# EAGLE schematic cs8416 (EAGLE 4.15)
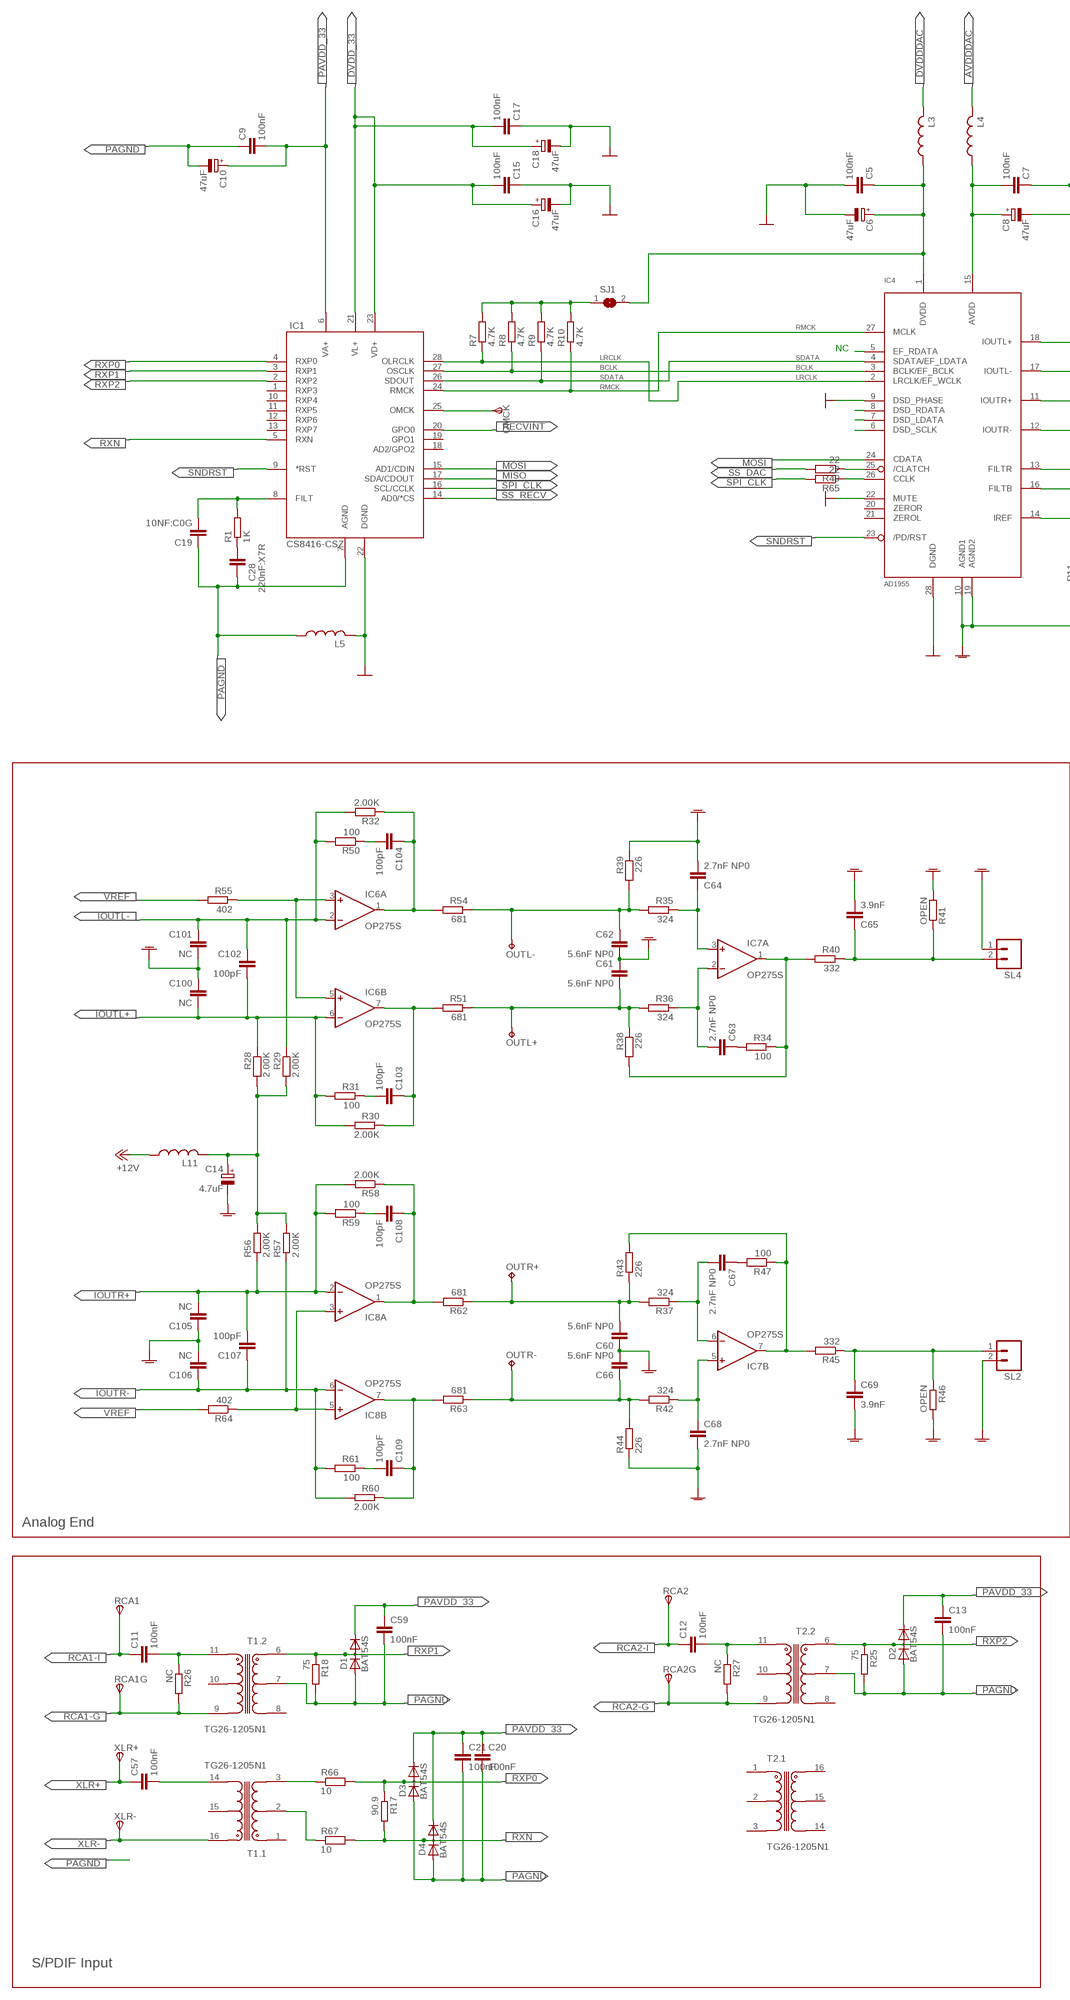
[diagram p0: schematic, sheet 1, part 1 of 2]
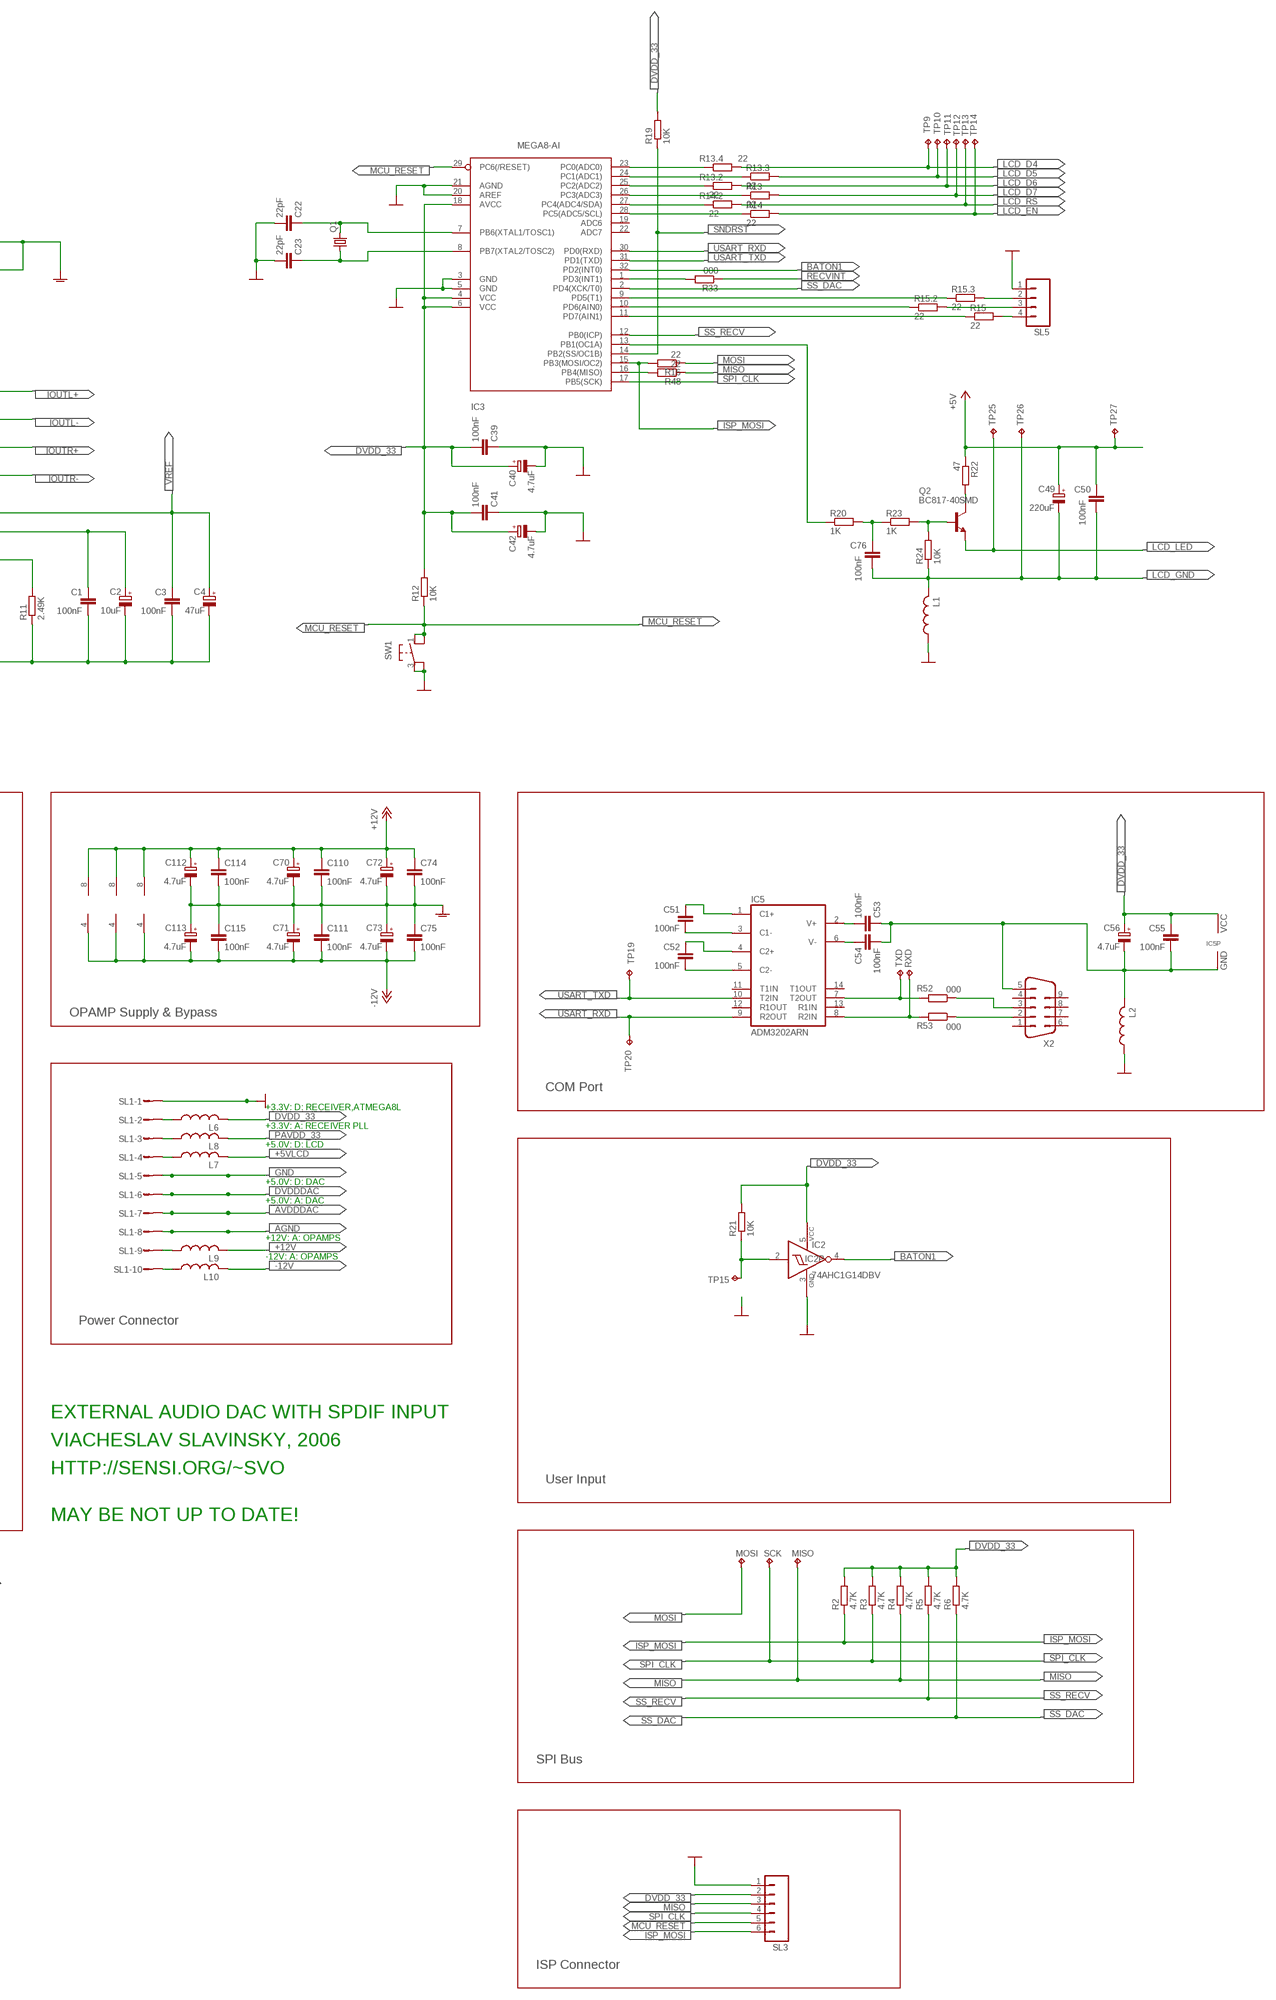
[diagram p1: schematic, sheet 1, part 2 of 2]

## Parts
C1  100nF  C-EUC0603  [C0603]
C2  10uF  CPOL-EUA/3216-18R  [A/3216-18R]
C3  100nF  C-EUC0603  [C0603]
C4  47uF  CPOL-EUB/3528-21R  [B/3528-21R]
C5  100nF  C-EUC0603  [C0603]
C6  47uF  CPOL-EUB/3528-21R  [B/3528-21R]
C7  100nF  C-EUC0603  [C0603]
C8  47uF  CPOL-EUB/3528-21R  [B/3528-21R]
C9  100nF  C-EUC0603  [C0603]
C10  47uF  CPOL-EUB/3528-21R  [B/3528-21R]
C11  100nF  C-EUC0603K  [C0603K]
C12  100nF  C-EUC0603K  [C0603K]
C13  100nF  C-EUC0603  [C0603]
C14  4.7uF  CPOL-EUB/3528-21R  [B/3528-21R]
C15  100nF  C-EUC0603  [C0603]
C16  47uF  CPOL-EUB/3528-21R  [B/3528-21R]
C17  100nF  C-EUC0603  [C0603]
C18  47uF  CPOL-EUB/3528-21R  [B/3528-21R]
C19  10NF:C0G  C-EUC0805  [C0805]
C20  100nF  C-EUC0603  [C0603]
C21  100nF  C-EUC0603  [C0603]
C22  22pF  C-EUC0603  [C0603]
C23  22pF  C-EUC0603  [C0603]
C28  220nF:X7R  C-EUC0805  [C0805]
C39  100nF  C-EUC0603  [C0603]
C40  4.7uF  CPOL-EUA/3216-18R  [A/3216-18R]
C41  100nF  C-EUC0603  [C0603]
C42  4.7uF  CPOL-EUA/3216-18R  [A/3216-18R]
C49  220uF  CPOL-EUSMCE  [SMC_E]
C50  100nF  C-EUC0603  [C0603]
C51  100nF  C-EUC0805S  [C0805S]
C52  100nF  C-EUC0805S  [C0805S]
C53  100nF  C-EUC0805S  [C0805S]
C54  100nF  C-EUC0805S  [C0805S]
C55  100nF  C-EUC0805S  [C0805S]
C56  4.7uF  CPOL-EUA/3216-18R  [A/3216-18R]
C57  100nF  C-EUC0603K  [C0603K]
C59  100nF  C-EUC0603  [C0603]
C60  5.6nF NP0  C-EUC0805  [C0805]
C61  5.6nF NP0  C-EUC0805  [C0805]
C62  5.6nF NP0  C-EUC0805  [C0805]
C63  2.7nF NP0  C-EUC0805  [C0805]
C64  2.7nF NP0  C-EUC0805  [C0805]
C65  3.9nF  C-EUC0805  [C0805]
C66  5.6nF NP0  C-EUC0805  [C0805]
C67  2.7nF NP0  C-EUC0805  [C0805]
C68  2.7nF NP0  C-EUC0805  [C0805]
C69  3.9nF  C-EUC0805  [C0805]
C70  4.7uF  CPOL-EUB/3528-21R  [B/3528-21R]
C71  4.7uF  CPOL-EUB/3528-21R  [B/3528-21R]
C72  4.7uF  CPOL-EUB/3528-21R  [B/3528-21R]
C73  4.7uF  CPOL-EUB/3528-21R  [B/3528-21R]
C74  100nF  C-EUC0603  [C0603]
C75  100nF  C-EUC0603  [C0603]
C76  100nF  C-EUC0805  [C0805]
C100  NC  C-EUC0805S  [C0805S]
C101  NC  C-EUC0805S  [C0805S]
C102  100pF  C-EUC0805S  [C0805S]
C103  100pF  C-EUC0805S  [C0805S]
C104  100pF  C-EUC0805S  [C0805S]
C105  NC  C-EUC0805S  [C0805S]
C106  NC  C-EUC0805S  [C0805S]
C107  100pF  C-EUC0805S  [C0805S]
C108  100pF  C-EUC0805S  [C0805S]
C109  100pF  C-EUC0805S  [C0805S]
C110  100nF  C-EUC0603  [C0603]
C111  100nF  C-EUC0603  [C0603]
C112  4.7uF  CPOL-EUB/3528-21R  [B/3528-21R]
C113  4.7uF  CPOL-EUB/3528-21R  [B/3528-21R]
C114  100nF  C-EUC0603  [C0603]
C115  100nF  C-EUC0603  [C0603]
D1  BAT54S  DIODE_2CACA-SOT23  [SOT23]
D2  BAT54S  DIODE_2CACA-SOT23  [SOT23]
D3  BAT54S  DIODE_2CACA-SOT23  [SOT23]
D4  BAT54S  DIODE_2CACA-SOT23  [SOT23]
IC1  CS8416-CSZ  [SO28W]
IC2  74AHC1G14DBV  [SOT23-5]
IC3  MEGA8-AI  [TQFP32-08]
IC4  AD1955  [SSOP28]
IC5  ADM3202ARN  [SO16]
IC6  OP275S  OP262D  [SO08]
IC7  OP275S  OP262D  [SO08]
IC8  OP275S  OP262D  [SO08]
L1  L-USL2825P  [L2825P]
L2  L-USL2825P  [L2825P]
L3  L-USL2825P  [L2825P]
L4  L-USL2825P  [L2825P]
L5  L-USL2825P  [L2825P]
L6  L-USL3216C  [L3216C]
L7  L-USL3216C  [L3216C]
L8  L-USL3216C  [L3216C]
L9  L-USL3216C  [L3216C]
L10  L-USL3216C  [L3216C]
L11  L-USL3216C  [L3216C]
MISO  TPTP10R  [TP10R]
MOSI  TPTP10R  [TP10R]
OMCK  TPSPAD1-13Y  [P1-13Y]
OUTL+  TPB1,27  [B1,27]
OUTL-  TPB1,27  [B1,27]
OUTR+  TPB1,27  [B1,27]
OUTR-  TPB1,27  [B1,27]
Q1  CRYTALHC49S  [HC49/S]
Q2  BC817-40SMD  [SOT23-BEC]
R1  1K  R-EU_R0805S  [R0805-SVO]
R2  4.7K  R-EU_R0805S  [R0805-SVO]
R3  4.7K  R-EU_R0805S  [R0805-SVO]
R4  4.7K  R-EU_R0805S  [R0805-SVO]
R5  4.7K  R-EU_R0805S  [R0805-SVO]
R6  4.7K  R-EU_R0805S  [R0805-SVO]
R7  4.7K  R-EU_R0603  [R0603]
R8  4.7K  R-EU_R0603  [R0603]
R9  4.7K  R-EU_R0603  [R0603]
R10  4.7K  R-EU_R0603  [R0603]
R11  2.49K  R-EU_0204/7  [0204/7]
R12  10K  R-EU_R0805S  [R0805-SVO]
R13  22  RESARRAY_YC  [RESSMD-YC16]
R14  22  RESARRAY_YC  [RESSMD-YC16]
R15  22  RESARRAY_YC  [RESSMD-YC16]
R16  22  R-EU_R0603  [R0603]
R17  90.9  R-EU_R0805S  [R0805-SVO]
R18  75  R-EU_R0805S  [R0805-SVO]
R19  10K  R-EU_R0805S  [R0805-SVO]
R20  1K  R-EU_R0805S  [R0805-SVO]
R21  10K  R-EU_R0805S  [R0805-SVO]
R22  47  R-EU_R0805S  [R0805-SVO]
R23  1K  R-EU_R0805S  [R0805-SVO]
R24  10K  R-EU_R0805S  [R0805-SVO]
R25  75  R-EU_R0805S  [R0805-SVO]
R26  NC  R-EU_R0805S  [R0805-SVO]
R27  NC  R-EU_R0805S  [R0805-SVO]
R28  2.00K  R-EU_0204/7  [0204/7]
R29  2.00K  R-EU_0204/7  [0204/7]
R30  2.00K  R-EU_0204/7  [0204/7]
R31  100  R-EU_R0805S  [R0805-SVO]
R32  2.00K  R-EU_0204/7  [0204/7]
R33  000  R-EU_GAP  [R1206-GAP]
R34  100  R-EU_R0805S  [R0805-SVO]
R35  324  R-EU_0204/7  [0204/7]
R36  324  R-EU_0204/7  [0204/7]
R37  324  R-EU_0204/7  [0204/7]
R38  226  R-EU_0204/7  [0204/7]
R39  226  R-EU_0204/7  [0204/7]
R40  332  R-EU_0204/7  [0204/7]
R41  OPEN  R-EU_R0805  [R0805]
R42  324  R-EU_0204/7  [0204/7]
R43  226  R-EU_0204/7  [0204/7]
R44  226  R-EU_0204/7  [0204/7]
R45  332  R-EU_0204/7  [0204/7]
R46  OPEN  R-EU_R0805  [R0805]
R47  100  R-EU_R0805S  [R0805-SVO]
R48  22  R-EU_R0603  [R0603]
R49  22  R-EU_R0603  [R0603]
R50  100  R-EU_R0805S  [R0805-SVO]
R51  681  R-EU_0204/7  [0204/7]
R52  000  R-EU_GAP  [R1206-GAP]
R53  000  R-EU_GAP  [R1206-GAP]
R54  681  R-EU_0204/7  [0204/7]
R55  402  R-EU_0204/7  [0204/7]
R56  2.00K  R-EU_0204/7  [0204/7]
R57  2.00K  R-EU_0204/7  [0204/7]
R58  2.00K  R-EU_0204/7  [0204/7]
R59  100  R-EU_R0805S  [R0805-SVO]
R60  2.00K  R-EU_0204/7  [0204/7]
R61  100  R-EU_R0805S  [R0805-SVO]
R62  681  R-EU_0204/7  [0204/7]
R63  681  R-EU_0204/7  [0204/7]
R64  402  R-EU_0204/7  [0204/7]
R65  22  R-EU_R0603  [R0603]
R66  10  R-EU_R0805S  [R0805-SVO]
R67  10  R-EU_R0805S  [R0805-SVO]
RCA1  TPSPAD1-13  [P1-13]
RCA1G  TPSPAD1-13  [P1-13]
RCA2  TPSPAD1-13  [P1-13]
RCA2G  TPSPAD1-13  [P1-13]
RXD  TPB1,27  [B1,27]
SCK  TPTP10R  [TP10R]
SJ1  SJ  [SJ]
SL1  M10S  [10P]
SL2  M02  [02P]
SL3  M06  [06P]
SL4  M02  [02P]
SL5  M04  [04P]
SW1  BUTTON_6X6_THRU  [6X6_BUTTON_THRU]
T1  TG26-1205N1  [SO16WW]
T2  TG26-1205N1  [SO16WW]
TP9  TPPAD1-10Y  [P1-13Y-SVO]
TP10  TPPAD1-10Y  [P1-13Y-SVO]
TP11  TPPAD1-10Y  [P1-13Y-SVO]
TP12  TPPAD1-10Y  [P1-13Y-SVO]
TP13  TPPAD1-10Y  [P1-13Y-SVO]
TP14  TPPAD1-10Y  [P1-13Y-SVO]
TP15  TPPAD1-10Y  [P1-13Y-SVO]
TP19  TPTP10R  [TP10R]
TP20  TPTP10R  [TP10R]
TP25  TPPAD1-10Y  [P1-13Y-SVO]
TP26  TPPAD1-10Y  [P1-13Y-SVO]
TP27  TPPAD1-10Y  [P1-13Y-SVO]
TXD  TPB1,27  [B1,27]
X2  M09HP  [M09HP]
XLR+  TPSPAD1-13  [P1-13]
XLR-  TPSPAD1-13  [P1-13]

## Nets
+5VLCD [supply]: C49.+ C50.1 L7.2 R22.1 TP27.1(TP) ; supply symbol labelled +5V
+12V [supply]: C70.+ C72.+ C74.1 C110.1 C112.+ C114.1 IC6.8(P:V+) IC7.8(P:V+) IC8.8(P:V+) L9.2 L11.1
-12V [supply]: C71.- C73.- C75.2 C111.2 C113.- C115.2 IC6.4(P:V-) IC7.4(P:V-) IC8.4(P:V-) L10.2
AGND: C1.2 C2.- C3.2 C4.- C7.1 C8.- C14.- C60.1 C61.1 C62.2 C64.2 C65.2 C66.2 C68.2 C69.2 C70.- C71.+ C72.- C73.+ C74.2 C75.1 C100.1 C101.2 C105.1 C106.2 C110.2 C111.1 C112.- C113.+ C114.2 C115.1 IC4.10(AGND1) IC4.19(AGND2) R11.1 R39.1 R41.2 R44.1 R46.2 SL1.8 SL2.2 SL4.1
AVDD: C7.2 C8.+ IC4.15(AVDD) L4.1
AVDDDAC [supply]: L4.2 SL1.7
B1IN: IC2.2(I) R21.1 TP15.1(TP)
BATON1: IC2.4(O) IC3.32(PD2(INT0))
BCLK: IC1.27(OSCLK) IC4.3(BCLK/EF_BCLK) R8.1
COM_GND [supply]: C53.1 C54.2 C55.2 C56.- IC5.15(GND) L2.2 X2.5
COM_RXD: IC5.8(R2IN) R53.2 RXD.PP(TP)
COM_TXD: IC5.7(T2OUT) R52.2 TXD.PP(TP)
DVDD: C5.1 C6.+ IC4.1(DVDD) L3.1 SJ1.2
DVDD_33 [supply]: C15.2 C16.+ C17.2 C18.+ C39.2 C40.+ C41.2 C42.+ C55.1 C56.+ IC1.21(VL+) IC1.23(VD+) IC2.5(VCC) IC3.4(VCC) IC3.6(VCC) IC3.18(AVCC) IC5.16(VCC) L6.2 R2.2 R3.2 R4.2 R5.2 R6.2 R12.2 R19.2 R21.2 SL3.2
DVDDDAC [supply]: L3.2 SL1.6
GND [supply]: C5.2 C6.- C15.1 C16.- C17.1 C18.- C22.2 C23.2 C39.1 C40.- C41.1 C42.- IC1.22(DGND) IC2.3(GND) IC3.3(GND) IC3.5(GND) IC3.20(AREF) IC3.21(AGND) IC4.9(DSD_PHASE) IC4.22(MUTE) IC4.28(DGND) L1.1 L2.1 L5.2 SL1.1 SL1.5 SL3.1 SL5.1 SW1.3(P1) SW1.4(P1)
IOUTL+: C100.2 C102.2 IC4.18(IOUTL+) IC6.6(B:-IN) R28.1 R30.2 R31.2
IOUTL-: C101.1 C102.1 IC4.17(IOUTL-) IC6.2(A:-IN) R29.1 R32.2 R50.2
IOUTR+: C105.2 C107.2 IC4.11(IOUTR+) IC8.2(A:-IN) R56.1 R58.2 R59.2
IOUTR-: C106.1 C107.1 IC4.12(IOUTR-) IC8.6(B:-IN) R57.1 R60.2 R61.2
ISP_MOSI: IC3.15(PB3(MOSI/OC2)) R2.1 R16.2 SL3.6
LCD_D4: R13.R4$2 TP9.1(TP)
LCD_D5: R13.R3$2 TP10.1(TP)
LCD_D6: R13.R2$2 TP11.1(TP)
LCD_D7: R13.R1$2 TP12.1(TP)
LCD_EN: R14.R1$2 TP14.1(TP)
LCD_GND: C49.- C50.2 C76.2 L1.2 R24.1 TP26.1(TP)
LCD_LED: Q2.E TP25.1(TP)
LCD_PWMIN: IC3.13(PB1(OC1A)) R20.1
LCD_RS: R14.R2$2 TP13.1(TP)
LRCLK: IC1.28(OLRCLK) IC4.2(LRCLK/EF_WCLK) R7.1
MCU_RESET: IC3.29(PC6(/RESET)) R12.1 SL3.5 SW1.1(P2) SW1.2
MISO: IC1.17(SDA/CDOUT) MISO.TP R4.1 R48.1 SL3.3
MOSI: IC1.15(AD1/CDIN) IC4.24(CDATA) MOSI.TP R16.1
N$1: C28.2 R1.1
N$2: IC4.5(EF_RDATA)
N$3 [supply]: C11.2 R26.1 T1.11(.2:SEC1)
N$4: IC4.6(DSD_SCLK)
N$5: IC4.7(DSD_LDATA)
N$6: IC4.8(DSD_RDATA)
N$7 [supply]: C12.2 R27.1 T2.11(.2:SEC1)
N$8: C57.2 T1.14(.1:SEC3)
N$9: C76.1 R20.2 R23.1
N$11: C22.1 IC3.7(PB6(XTAL1/TOSC1)) Q1.2
N$12: R7.2 R8.2 R9.2 R10.2 SJ1.1
N$15: C51.2 IC5.3(C1-)
N$16: Q2.C R22.2
N$18: IC3.23(PC0(ADC0)) R13.R4$1
N$19: IC3.24(PC1(ADC1)) R13.R3$1
N$20: IC3.25(PC2(ADC2)) R13.R2$1
N$21: IC3.26(PC3(ADC3)) R13.R1$1
N$22: IC3.27(PC4(ADC4/SDA)) R14.R2$1
N$23: IC3.28(PC5(ADC5/SCL)) R14.R1$1
N$24 [supply]: C103.2 R31.1
N$25: Q2.B R23.2 R24.2
N$26: C51.1 IC5.1(C1+)
N$27: C52.1 IC5.4(C2+)
N$28: R15.R2$2 SL5.3
N$29: R15.R1$2 SL5.4
N$30: R15.R3$2 SL5.2
N$31: IC3.9(PD5(T1)) R15.R3$1
N$32: IC3.10(PD6(AIN0)) R15.R2$1
N$33: IC3.11(PD7(AIN1)) R15.R1$1
N$34: C52.2 IC5.5(C2-)
N$35: C53.2 IC5.2(V+)
N$36: C54.1 IC5.6(V-)
N$37: IC4.14(IREF) R11.2
N$38 [supply]: L6.1 SL1.2
N$39: C1.1 C2.+ IC4.16(FILTB)
N$40: C63.2 IC7.2(A:-IN) R36.1
N$41: C64.1 IC7.3(A:+IN) R35.1
N$42 [supply]: C103.1 IC6.7(B:OUT) R30.1 R51.2
N$43: IC3.16(PB4(MISO)) R48.2
N$44: C67.2 IC7.6(B:-IN) R37.1
N$45: C68.1 IC7.5(B:+IN) R42.1
N$46 [supply]: L7.1 SL1.4
N$48: C63.1 R34.2
N$50: IC7.7(B:OUT) R43.2 R45.2 R47.1
N$51: R53.1 X2.2
N$52: IC7.1(A:OUT) R34.1 R38.2 R40.2
N$53 [supply]: L8.1 SL1.3
N$54 [supply]: L9.1 SL1.9
N$55: C67.1 R47.2
N$56: IC4.26(CCLK) R65.1
N$57: IC4.25(/CLATCH) R49.1
N$58: R52.1 X2.3
N$60 [supply]: L10.1 SL1.10
N$61 [supply]: C14.+ L11.2 R28.2 R29.2 R56.2 R57.2
N$62: R66.1 T1.3(.1:PRI3)
N$63: R67.1 T1.2(.1:PRI2)
N$79 [supply]: C104.1 IC6.1(A:OUT) R32.1 R54.2
N$80 [supply]: C108.1 IC8.1(A:OUT) R58.1 R62.2
N$81 [supply]: C104.2 R50.1
N$82 [supply]: C108.2 R59.1
N$83 [supply]: C109.1 IC8.7(B:OUT) R60.1 R63.2
N$84 [supply]: C109.2 R61.1
N$88: C23.1 IC3.8(PB7(XTAL2/TOSC2)) Q1.1
OMCK: IC1.25(OMCK) OMCK.1(PP)
PAGND [supply]: C9.1 C10.- C13.2 C19.1 C20.2 C21.2 C28.1 C59.2 D1.1(A) D2.1(A) D3.1(A) D4.1(A) IC1.7(AGND) L5.1 R18.2 R25.2 T1.7(.2:PRI2) T2.7(.2:PRI2)
PAVDD_33 [supply]: C9.2 C10.+ C13.1 C20.1 C21.1 C59.1 D1.2(C) D2.2(C) D3.2(C) D4.2(C) IC1.6(VA+) L8.2
PLL_LF1: C19.2 IC1.8(FILT) R1.2
RCA1-G: R26.2 RCA1G.1(PP) T1.9(.2:SEC3)
RCA1-I: C11.1 RCA1.1(PP)
RCA2-G: R27.2 RCA2G.1(PP) T2.9(.2:SEC3)
RCA2-I: C12.1 RCA2.1(PP)
RECVINT: IC1.20(GPO0) R33.1
RMCK: IC1.24(RMCK) IC4.27(MCLK) R10.1
RXN: D4.3(AC) IC1.5(RXN) R17.2 R67.2
RXP0: D3.3(AC) IC1.4(RXP0) R17.1 R66.2
RXP1: D1.3(AC) IC1.3(RXP1) R18.1 T1.6(.2:PRI1)
RXP2: D2.3(AC) IC1.2(RXP2) R25.1 T2.6(.2:PRI1)
SDATA: IC1.26(SDOUT) IC4.4(SDATA/EF_LDATA) R9.1
SNDRST: IC1.9(*RST) IC3.14(PB2(SS/OC1B)) IC4.23(/PD/RST) R19.1
SPDIF_INT: IC3.1(PD3(INT1)) R33.2
SPI_CLK: IC1.16(SCL/CCLK) IC3.17(PB5(SCK)) R3.1 R65.2 SCK.TP SL3.4
SS_DAC: IC3.2(PD4(XCK/T0)) R6.1 R49.2
SS_RECV: IC1.14(AD0/*CS) IC3.12(PB0(ICP)) R5.1
USART_RXD: IC3.30(PD0(RXD)) IC5.9(R2OUT) TP20.TP
USART_TXD: IC3.31(PD1(TXD)) IC5.10(T2IN) TP19.TP
VBIASX: IC6.3(A:+IN) IC6.5(B:+IN) R55.1
VBIASY: IC8.3(A:+IN) IC8.5(B:+IN) R64.1
VOUT_LEFT: C65.1 R40.1 R41.1 SL4.2
VOUT_RIGHT: C69.1 R45.1 R46.1 SL2.1
VOUTL+: C61.2 OUTL+.PP(TP) R36.2 R38.1 R51.1
VOUTL-: C62.1 OUTL-.PP(TP) R35.2 R39.2 R54.1
VOUTR+: C60.2 OUTR+.PP(TP) R37.2 R43.1 R62.1
VOUTR-: C66.1 OUTR-.PP(TP) R42.2 R44.2 R63.1
VREF: C3.1 C4.+ IC4.13(FILTR) R55.2 R64.2
XLR+: C57.1 XLR+.1(PP)
XLR-: T1.16(.1:SEC1) XLR-.1(PP)
Unconnected: IC1.1(RXP3) IC1.10(RXP4) IC1.11(RXP5) IC1.12(RXP6) IC1.13(RXP7) IC1.18(AD2/GPO2) IC1.19(GPO1) IC3.19(ADC6) IC3.22(ADC7) IC4.20(ZEROR) IC4.21(ZEROL) IC5.11(T1IN) IC5.12(R1OUT) IC5.13(R1IN) IC5.14(T1OUT) R14.R3$1 R14.R3$2 R14.R4$1 R14.R4$2 R15.R4$1 R15.R4$2 T1.1(.1:PRI1) T1.8(.2:PRI3) T1.10(.2:SEC2) T1.15(.1:SEC2) T2.1(.1:PRI1) T2.2(.1:PRI2) T2.3(.1:PRI3) T2.8(.2:PRI3) T2.10(.2:SEC2) T2.14(.1:SEC3) T2.15(.1:SEC2) T2.16(.1:SEC1) X2.1 X2.4 X2.6 X2.7 X2.8 X2.9

## Notes on the sheet
- NC
- OPAMP Supply & Bypass
- COM Port
- +3.3V: D: RECEIVER,ATMEGA8L
- +3.3V: A: RECEIVER PLL
- +5.0V: D: LCD
- +5.0V: D: DAC
- +5.0V: A: DAC
- +12V: A: OPAMPS
- -12V: A: OPAMPS
- Power Connector
- EXTERNAL AUDIO DAC WITH SPDIF INPUT
- VIACHESLAV SLAVINSKY, 2006
- HTTP://SENSI.ORG/~SVO
- User Input
- Analog End | MAY BE NOT UP TO DATE!
- SPI Bus
- S/PDIF Input
- ISP Connector

## Library data of the parts
C1 C3 C5 C7 C9 C11-C13 C15 C17 C19-C23 C28 C39 C41 C50-C55 C57 C59-C69 C74-C76 C100-C111 C114 C115 = rcl:C-EU: CAPACITOR, European symbol
C2 C4 C6 C8 C10 C14 C16 C18 C40 C42 C49 C56 C70-C73 C112 C113 = rcl:CPOL-EU: POLARIZED CAPACITOR, European symbol
D1-D4 = diode:DIODE_2CACA-: 2 Diodes - Cathode-Anode|Cathode-Anode
IC1 = cs84xx:CS8416-*: 192kHz Digital Audio Interface Receiver
IC2 = 74xx-little-us:74*1G14: Single Schmitt-Trigger Inverter Gate
IC3 = avr:MEGA8: MICROCONTROLLER 8 Kbytes FLASH 1 kbytes SRAM 512 bytes EEPROM USART 6-channel 10 bit ADC 2-channel 8 bit ADC
IC4 = 0-ad1955:AD1955
IC5 = 0-ADI-variety:ADM3202*
IC6-IC8 = linear:OP262: OP AMP
L1-L11 = rcl:L-US: INDUCTOR, American symbol
MISO MOSI OUTL+ OUTL- OUTR+ OUTR- RXD SCK TP9-TP15 TP19 TP20 TP25-TP27 TXD = testpad:TP
OMCK RCA1 RCA1G RCA2 RCA2G XLR+ XLR- = 0-svo:TPS: TEST PIN
Q1 = crystal:CRYTAL: CRYSTAL
Q2 = transistor-npn:BC817*: NPN Transistor
R1-R12 R16-R67 = rcl:R-EU_: RESISTOR, European symbol
R13-R15 = 0-svo:RESARRAY_YC*: RESISTOR ARRAY YC16, 1/16W 0.8mm lead pitch
SJ1 = jumper:SJ: SMD solder JUMPER
SL1 = con-amp-quick:M10S: AMP QUICK CONNECTOR
SL2 SL4 = con-amp-quick:M02: AMP QUICK CONNECTOR
SL3 = con-amp-quick:M06: AMP QUICK CONNECTOR
SL5 = con-amp-quick:M04: AMP QUICK CONNECTOR
SW1 = 0-svo:BUTTON_6X6_*
T1 T2 = 0_trafo-halo:TG26-1205N1
X2 = con-subd:M09: SUB-D

## Net classes
1 supply: width 0.406 mm, drill 0.305 mm, clearance 0.5 mm